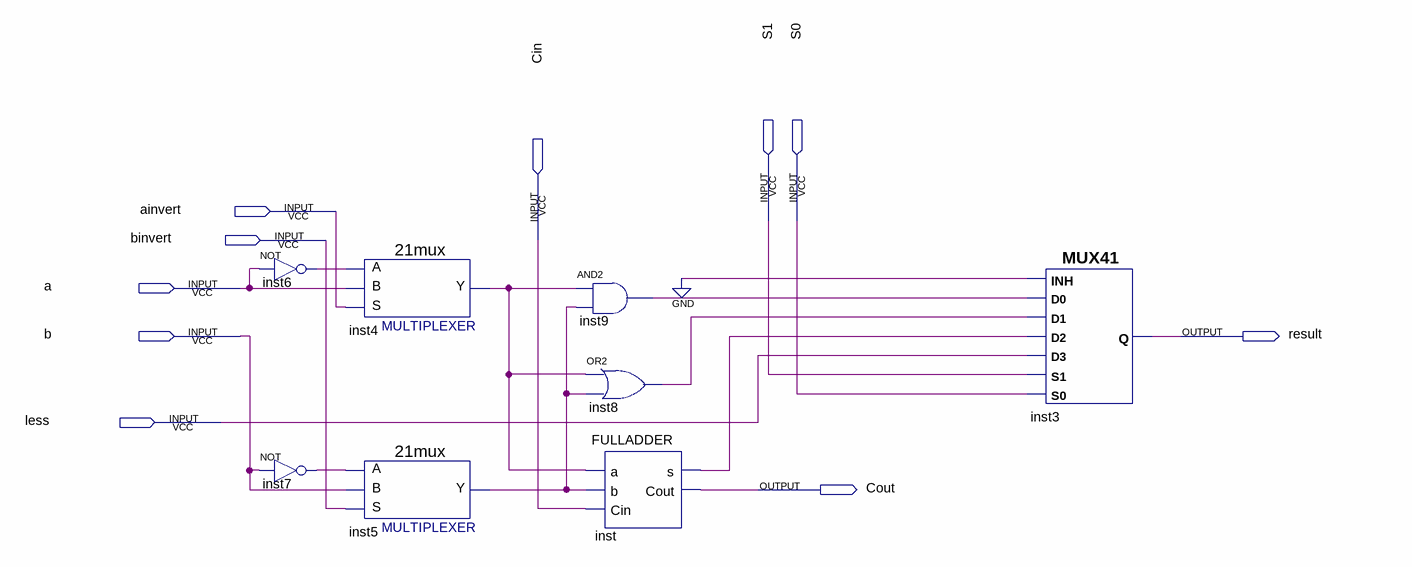
[diagram p0: schematic sheet]
// Quartus schematic ULU1bit.bdf as structural Verilog: 8 symbols, 10 pins
module ULU1bit (
  input  ainvert,
  input  S1,
  input  S0,
  input  binvert,
  input  Cin,
  input  a,
  input  b,
  input  less,
  output result,
  output Cout
);

  wire inst4_y, inst5_y, inst6_out, inst7_out, inst8_out, inst9_out, inst_s;

  not inst6 (inst6_out, a);
  not inst7 (inst7_out, b);
  \21mux  inst4 (.S(ainvert), .B(a), .A(inst6_out), .Y(inst4_y));
  \21mux  inst5 (.S(binvert), .B(b), .A(inst7_out), .Y(inst5_y));
  and inst9 (inst9_out, inst4_y, inst5_y);
  or inst8 (inst8_out, inst4_y, inst5_y);
  FULLADDER inst (.a(inst4_y), .b(inst5_y), .Cin(Cin), .s(inst_s), .Cout(Cout));
  MUX41 inst3 (.S0(S0), .D2(inst_s), .S1(S1), .D3(less), .D0(inst9_out), .INH(1'b0), .D1(inst8_out), .Q(result));
endmodule
